# EAGLE design rs485Adaptor (EAGLE 8.5.1)
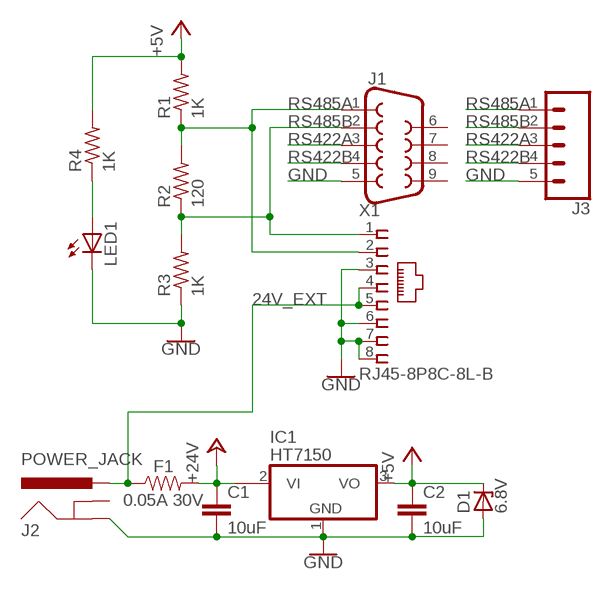
[diagram p0: schematic, sheet 1]

## Parts
C1  10uF  10UF-1206-6.3V-20%  [1206]
C2  10uF  C-EUC0805K  [C0805K]
D1  6.8V  ZENER-DIODESOD80C  [SOD80C]
F1  0.05A 30V  0.1OHM-1210-1/2W-1%  [1210]
IC1  HT7150  MCP170350MB  [SOT89]
J1  DB9FEMALE  [DB9]
J2  POWER_JACK  [POWER_JACK_PTH]
J3  CONN_05SCREW  [SCREWTERMINAL-3.5MM-5]
LED1  LEDCHIP-LED0805  [CHIP-LED0805]
R1  1K  R-US_R0805  [R0805]
R2  120  R-US_R0805  [R0805]
R3  1K  R-US_R0805  [R0805]
R4  1K  R-US_R0805  [R0805]
X1  RJ45-8P8C-8L-B  [RJ45-SHIELD-DS1128-S80BP]

## Nets
24V_EXT: F1.1 J2.PWR X1.4 X1.5
+5V: C2.1 D1.C IC1.3(VO) R1.2 R4.2
+24V: C1.1 F1.2 IC1.2@1(VI1)
GND: C1.2 C2.2 D1.A IC1.1(GND) J1.5 J2.GND J3.5 LED1.C R3.1 X1.3 X1.6 X1.7 X1.8
N$3: LED1.A R4.1
RS422A: J1.3 J3.3
RS422B: J1.4 J3.4
RS485A: J1.1 J3.1 R1.1 R2.2 X1.2
RS485B: J1.2 J3.2 R2.1 R3.2 X1.1
Unconnected: IC1.2(VI) J1.6 J1.7 J1.8 J1.9 J2.GNDBREAK

## Library data of the parts
C1 = SparkFun-Capacitors:10UF: 10.0µF ceramic capacitors A capacitor is a passive two-terminal electrical component used to store electrical energy temporarily in an electric field.; PROD_ID: CAP-10057
C2 = resistor:C-EU: CAPACITOR, European symbol
D1 = diode:ZENER-DIODE: Z-Diode
F1 = SparkFun-Resistors:0.1OHM: 0.1Ω resistor A resistor is a passive two-terminal electrical component that implements electrical resistance as a circuit element. Resistors act to reduce current flow, and, at the same time, act to lower voltage levels within circuits. - Wikipedia; PROD_ID: RES-12374; VALUE: 0.1
IC1 = linear:MCP1703*: 250 mA, 16V, Low Quiescent Current LDO Regulator Source: http://ww1.microchip.com/downloads/en/DeviceDoc/22049b.pdf
J1 = SparkFun-Connectors:DB9: DB9 Connector Standard DB9 (D-Sub 9) serial connector. Can be used for CAN bus as well as RS485 and RS232. Footprint production proven. Here is the female version connector we sell at SparkFun: 9 Pin Female Serial Connector - PCB Mount <https://www.sparkfun.com/products/429> (PRT-00429) This connector has been used on the following SparkFun products: SparkFun RS232 Shifter - SMD <https://www.sparkfun.com/products/449> (PRT-00449) SparkFun RS232 Shifter SMD (No DB9) <https://www.sparkfun.com/products/8780> (PRT-08780); PROD_ID: CONN-08194
J2 = SparkFun-Connectors:POWER_JACK: Power Jack Connector This is the standard 5.5mm barrel jack for power. The PTH is the most common, proven, reliable, footprint. The Slot footprint only works if the mill layer is transmitted to the PCB fab house so be warned. Here are the connectors we sell at SparkFun: DC Barrel Power Jack/Connector <https://www.sparkfun.com/products/119> (PRT-00119) DC Barrel Power Jack/Connector (SMD) <https://www.sparkfun.com/products/12748> (PRT-12748) DC Barrel Jack Adapter - Breadboard Compatible <https://www.sparkfun.com/products/10811> (PRT-10811) It is used on this SparkFun product (and many, many others): SparkFun RedBoard - Programmed with Arduino <https://www.sparkfun.com/products/12757> (DEV-12757) Also, if you need a mating power supply or connector, please check these out: Wall Adapter Power Supply - 9VDC 650mA <https://www.sparkfun.com/products/298> (TOL-00298) DC Barrel Jack Adapter - Male <https://www.sparkfun.com/products/10287> (PRT-10287); PROD_ID: CONN-08197
J3 = SparkFun-Connectors:CONN_05: Multi connection point. Often used as Generic Header-pin footprint for 0.1 inch spaced/style header connections On any of the 0.1 inch spaced packages, you can populate with these: Break Away Headers - Straight <https://www.sparkfun.com/products/116> (PRT-00116) Break Away Male Headers - Right Angle <https://www.sparkfun.com/products/553> (PRT-00553) Female Headers <https://www.sparkfun.com/products/115> (PRT-00115) Break Away Headers - Machine Pin <https://www.sparkfun.com/products/117> (PRT-00117) Break Away Female Headers - Swiss Machine Pin <https://www.sparkfun.com/products/743> (PRT-00743) For SCREWTERMINALS and SPRING TERMINALS visit here: Screw Terimnals on SparkFun.com <https://www.sparkfun.com/search/results?term=Screw+Terminals> (5mm/3.5mm/2.54mm spacing) This device is also useful as a general connection point to wire up your design to another part of your project. Our various solder wires solder well into these plated through hole pads. Hook-Up Wire - Assortment (Stranded, 22 AWG) <https://www.sparkfun.com/products/11375> (PRT-11375) Hook-Up Wire - Assortment (Solid Core, 22 AWG) <https://www.sparkfun.com/products/11367> (PRT-11367) View the entire wire category on our website here <https://www.sparkfun.com/categories/141> Special notes: Molex polarized connector foot print use with SKU : PRT-08231 with associated crimp pins and housings. 1MM SMD Version SKU: PRT-10208; PROD_ID: Combine 8288+8399
LED1 = led:LED: LED OSRAM: - CHIPLED LG R971, LG N971, LY N971, LG Q971, LY Q971, LO R971, LY R971 LH N974, LH R974 LS Q976, LO Q976, LY Q976 LO Q996 - Hyper CHIPLED LW Q18S LB Q993, LB Q99A, LB R99A - SideLED LS A670, LO A670, LY A670, LG A670, LP A670 LB A673, LV A673, LT A673, LW A673 LH A674 LY A675 LS A676, LA A676, LO A676, LY A676, LW A676 LS A679, LY A679, LG A679 - Hyper Micro SIDELED® LS Y876, LA Y876, LO Y876, LY Y876 LT Y87S - SmartLED LW L88C, LW L88S LB L89C, LB L89S, LG L890 LS L89K, LO L89K, LY L89K LS L896, LA L896, LO L896, LY L896 - TOPLED LS T670, LO T670, LY T670, LG T670, LP T670 LSG T670, LSP T670, LSY T670, LOP T670, LYG T670 LG T671, LOG T671, LSG T671 LB T673, LV T673, LT T673, LW T673 LH T674 LS T676, LA T676, LO T676, LY T676, LB T676, LH T676, LSB T676, LW T676 LB T67C, LV T67C, LT T67C, LS T67K, LO T67K, LY T67K, LW E67C LS E67B, LA E67B, LO E67B, LY E67B, LB E67C, LV E67C, LT E67C LW T67C LS T679, LY T679, LG T679 LS T770, LO T770, LY T770, LG T770, LP T770 LB T773, LV T773, LT T773, LW T773 LH T774 LS E675, LA E675, LY E675, LS T675 LS T776, LA T776, LO T776, LY T776, LB T776 LHGB T686 LT T68C, LB T68C - Hyper Mini TOPLED® LB M676 - Mini TOPLED Santana® LG M470 LS M47K, LO M47K, LY M47K Source: http://www.osram.convergy.de LUXEON: - LUMILED® LXK2-PW12-R00, LXK2-PW12-S00, LXK2-PW14-U00, LXK2-PW14-V00 LXK2-PM12-R00, LXK2-PM12-S00, LXK2-PM14-U00 LXK2-PE12-Q00, LXK2-PE12-R00, LXK2-PE12-S00, LXK2-PE14-T00, LXK2-PE14-U00 LXK2-PB12-K00, LXK2-PB12-L00, LXK2-PB12-M00, LXK2-PB14-N00, LXK2-PB14-P00, LXK2-PB14-Q00 LXK2-PR12-L00, LXK2-PR12-M00, LXK2-PR14-Q00, LXK2-PR14-R00 LXK2-PD12-Q00, LXK2-PD12-R00, LXK2-PD12-S00 LXK2-PH12-R00, LXK2-PH12-S00 LXK2-PL12-P00, LXK2-PL12-Q00, LXK2-PL12-R00 Source: www.luxeon.com KINGBRIGHT: KA-3528ASYC Source: www.kingbright.com
R1-R4 = resistor:R-US_: RESISTOR, American symbol
X1 = myownParts:RJ45-8P8C: CORCOM Modular RJ Jacks No Shield Source: www.tycoelectronics.com .. ENG_DS_1654001_1099_RJ_L_0507.pdf; MF: TYCO ELECTRONICS; MPN: RJ45-8L-B; OC_FARNELL: 1279843; OC_NEWARK: 52K4445

## Board
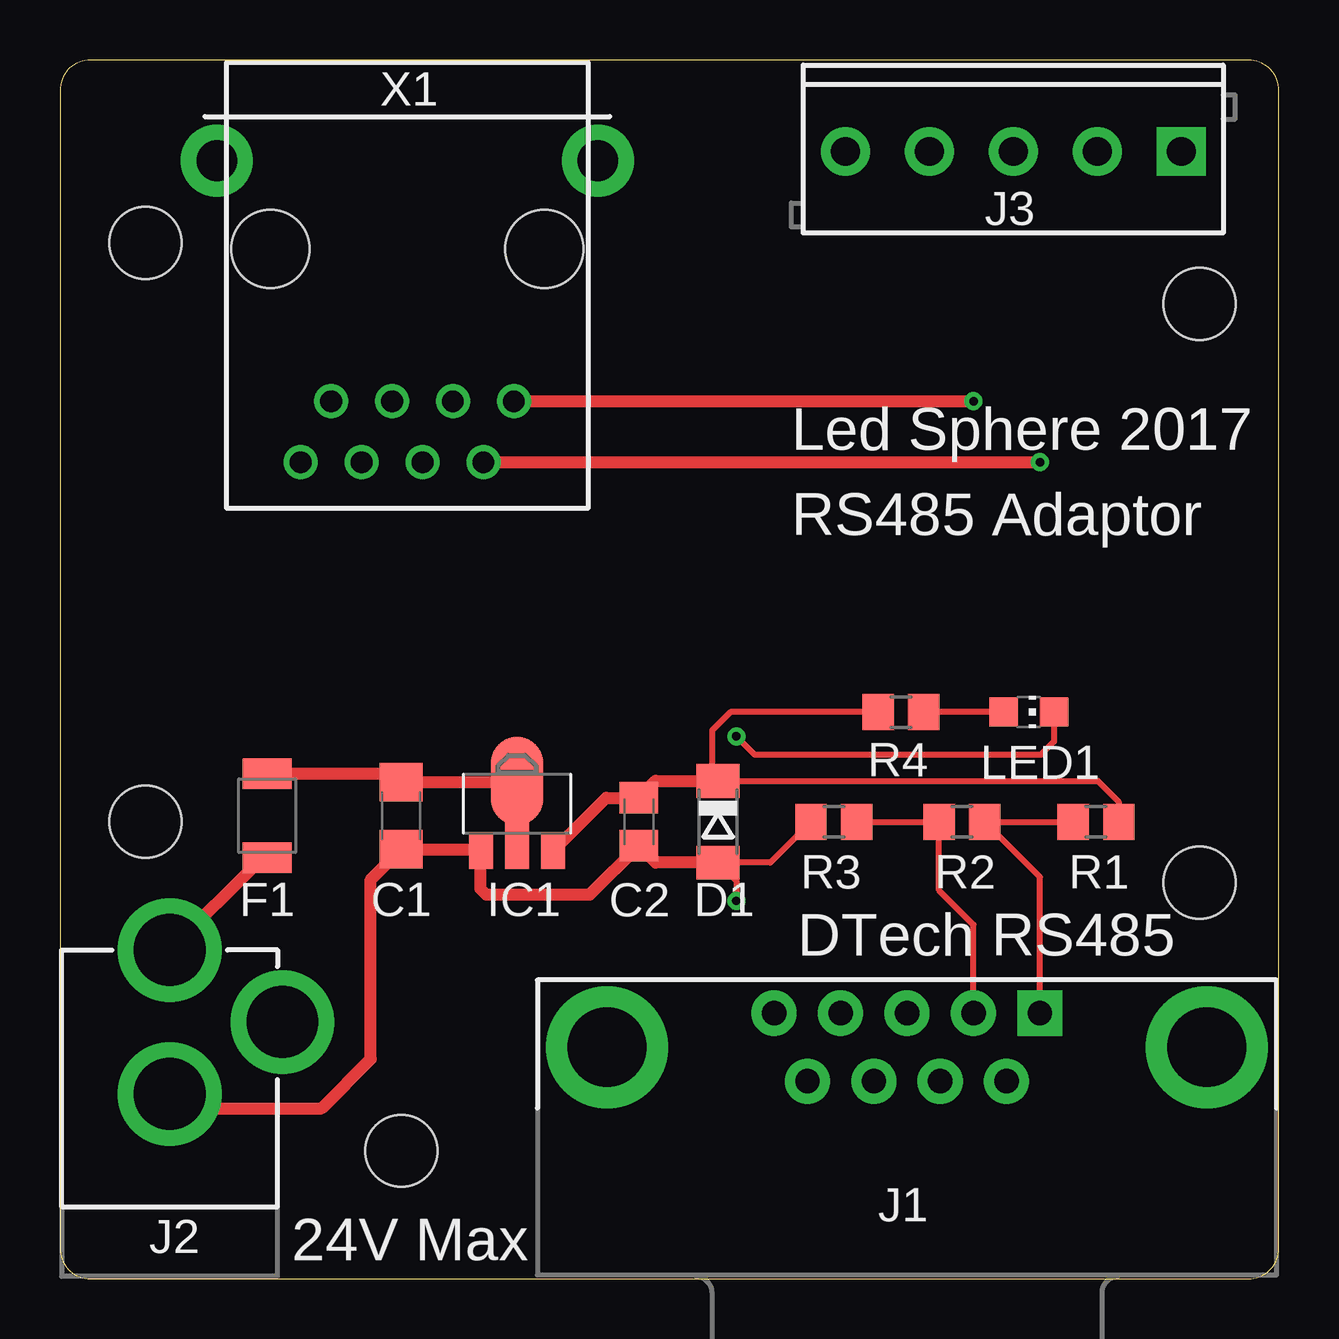
[diagram p1: board, top side]
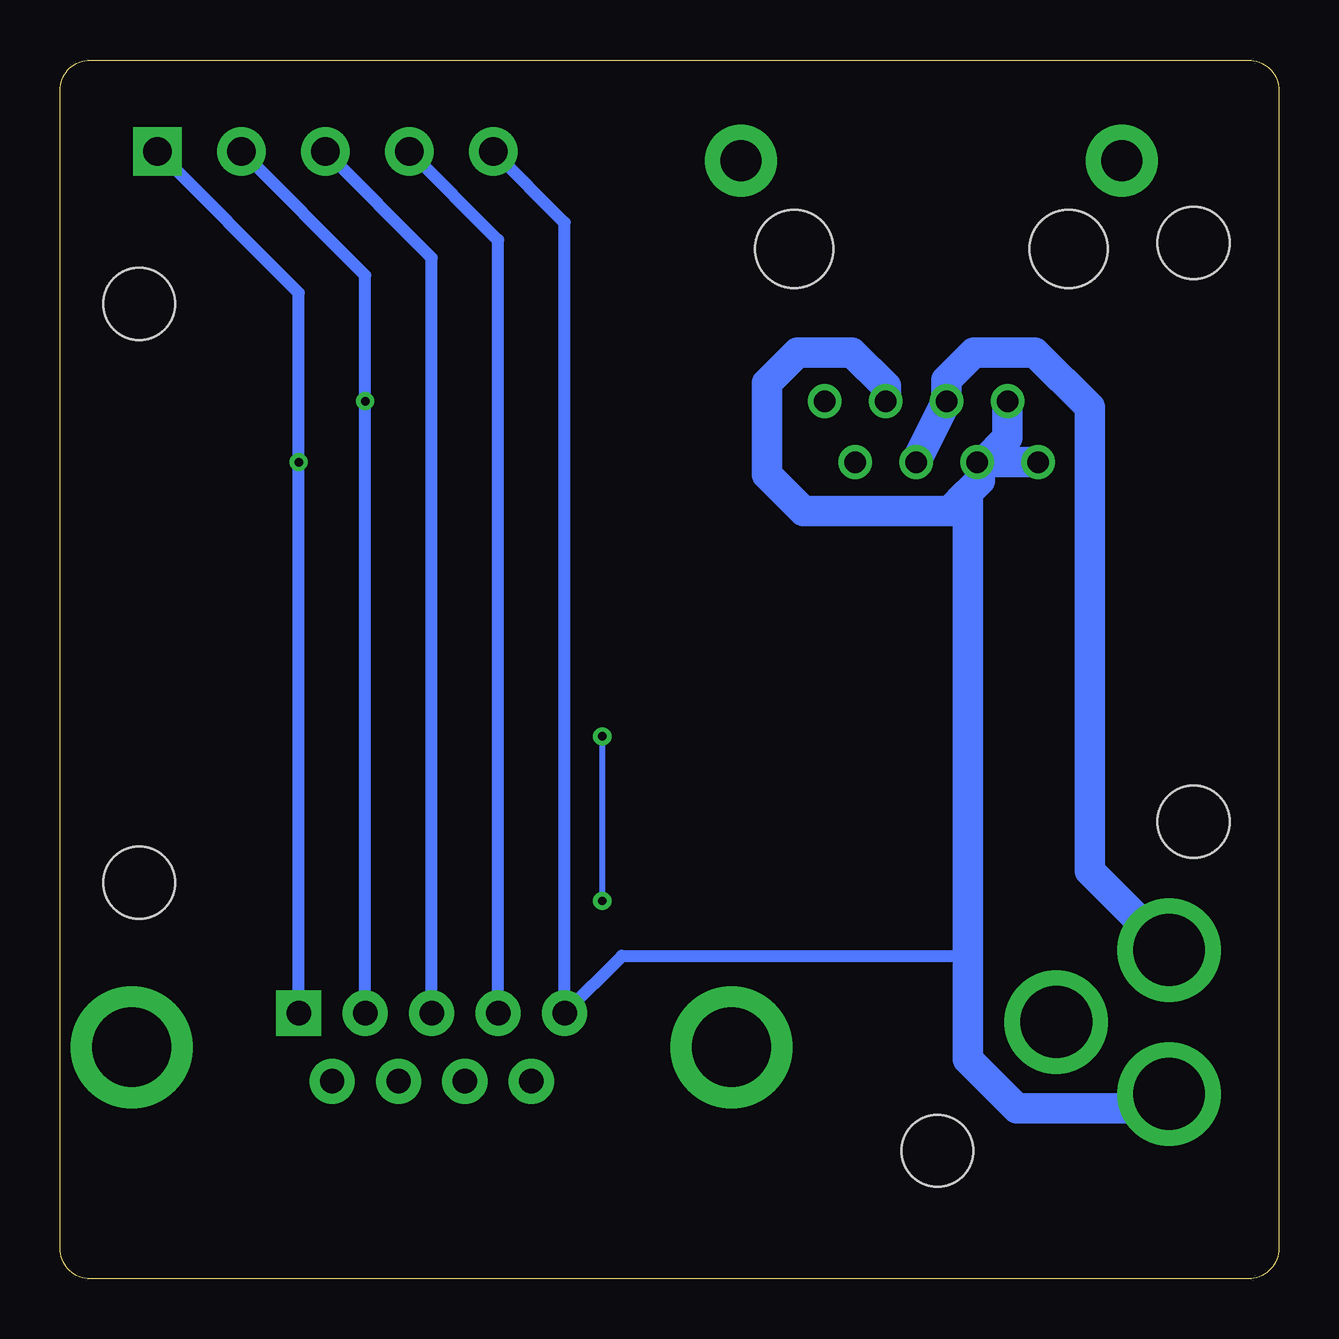
[diagram p2: board, bottom side, seen from below]

Size 50.8 x 50.8 mm. Coordinates in mm from the lower left corner, seen from the top.
Outline: 1.27,0 49.53,0 arc90 50.8,1.27 50.8,49.53 arc90 49.53,50.8 1.27,50.8 arc90 0,49.53 0,1.27 arc90 1.27,0
Copper layers (1*16): Top 0.035mm / dielectric 1.5mm / Bottom 0.035mm
Design rules "eagleRules": minimum track width 10mil, minimum drill 0.3mm, track to track 10mil, track to pad 10mil, pad to pad 10mil, via to via 10mil, smd to smd 10mil, copper to edge 20mil, drill to drill 20mil, minimum pad ring 10mil, minimum via ring 8mil, stop-mask expansion 4mil, vias tented up to drill 14mil, thermal gap 10mil
Holes 3 mm at 14.22,5.33 47.5,16.51 3.56,19.05 47.5,40.64 3.56,43.18

### Footprints (pad centres in the part's own frame; a part is rotated, then mirrored left to right if it is on the bottom)
1206 = smd 1.6 x 1.8: 1 -1.4,0; 2 1.4,0
C0805K = smd 1.3 x 1.6: 1 -1,0; 2 1,0
SOD80C = smd 1.4 x 1.8: A 1.7,0; C -1.7,0
1210 = smd 1.27 x 2.06: 1 -1.755,0; 2 1.755,0
SOT89 = smd 1 x 1.5: 1 -1.499,-1.981; 3 1.499,-1.981 | smd 1 x 2: 2 0,-1.727 | smd 2.2 x 3.7: 2@1 0,0.94
DB9 = drill 1.016 pad 1.88 square: 1 -5.54,-1.42 | drill 1.016 pad 1.88: 2 -2.77,-1.42; 3 0,-1.42; 4 2.77,-1.42; 5 5.54,-1.42; 6 -4.15,1.42; 7 -1.38,1.42; 8 1.38,1.42; 9 4.15,1.42 | drill 3.302 pad 5.08: G1 -12.5,0; G2 12.5,0
POWER_JACK_PTH = drill 2.997 pad 4.318: GND 0,7.7; GNDBREAK 4.7,10.7; PWR 0,13.7
SCREWTERMINAL-3.5MM-5 = drill 1.2 pad 2.032 square: 1 0,0 | drill 1.2 pad 2.032: 2 3.5,0; 3 7,0; 4 10.5,0; 5 14,0
CHIP-LED0805 = smd 1.2 x 1.2: A 0,-1.05; C 0,1.05
R0805 = smd 1.3 x 1.5: 1 -0.95,0; 2 0.95,0
RJ45-SHIELD-DS1128-S80BP = drill 0.9 pad 1.4: 1 -4.445,6.35; 2 -3.175,8.89; 3 -1.905,6.35; 4 -0.635,8.89; 5 0.635,6.35; 6 1.905,8.89; 7 3.175,6.35; 8 4.445,8.89 | drill 1.7 pad 3: SHIELD1 -7.94,-3.68; SHIELD2 7.94,-3.68 | hole 3.251: -5.715,0; 5.715,0

### Placement (x,y rotation side)
C1  14.22,19.3 270 top
C2  24.13,19.05 270 top
D1  27.43,19.05 270 top
F1  8.64,19.3 90 top
IC1  19.05,19.81 0 top
J1  35.31,9.65 180 top
J2  4.57,0 0 top
J3  46.74,46.99 180 top
LED1  40.39,23.62 270 top
R1  43.18,19.05 0 top
R2  37.59,19.05 0 top
R3  32.26,19.05 0 top
R4  35.05,23.62 180 top
X1  14.48,42.93 180 top

### Tracks (layer width: path | path; a pad name or v marks a point on that pad's centre or on a via)
24V_EXT
  Top 0.508: J2.PWR 8.42,17.55 F1.1
  Bottom 1.27: X1.4 X1.5 13.84,37.47 12.7,38.61 10.16,38.61 7.87,36.32 7.87,17 J2.PWR
+5V
  Top 0.254: D1.C 43.26,20.75 44.13,19.88 R1.2 | R4.2 27.94,23.62 27.18,22.86 27.18,21 26.92,20.75
  Top 0.508: IC1.3 22.77,20.05 C2.1 24.83,20.75 26.92,20.75 D1.C
+24V
  Top 0.508: F1.2 13.87,21.06 C1.1 19,20.7 IC1.2@1
GND  (via drill 0.35)
  Top 0.254: R3.1 29.61,17.35 D1.A 28.19,16.59 v28.19,15.75 | v28.19,22.61 28.96,21.84 40.89,21.84 41.44,22.39 LED1.C
  Top 0.508: J2.GND 5.16,7.11 10.92,7.11 12.95,9.14 12.95,16.63 C1.2 17.48,17.9 17.53,17.86 | 17.53,17.86 IC1.1 | 17.53,17.86 17.53,16.26 17.78,16 22.08,16 C2.2 24.83,17.35 D1.A
  Bottom 0.254: v28.19,15.75 v28.19,22.61
  Bottom 0.508: J3.5 29.77,44.02 J1.5 27.38,13.46 12.95,13.46
  Bottom 1.27: J2.GND 5.16,7.11 10.92,7.11 12.95,9.14 12.95,13.46 12.95,32.77 | 12.95,32.77 12.45,33.27 12.45,33.91 | 12.45,33.91 X1.6 | X1.7 11.3,35.05 12.32,34.04 | X1.8 12.32,34.04 | 12.32,34.04 12.45,33.91 | X1.3 16.38,37.21 17.78,38.61 20.07,38.61 21.34,37.34 21.34,33.53 19.81,32 13.72,32 12.95,32.77
N$3
  Top 0.254: LED1.A R4.1
RS422A
  Bottom 0.508: J1.3 35.31,42.56 J3.3
RS422B
  Bottom 0.508: J1.4 32.54,43.29 J3.4
RS485A  (via drill 0.35)
  Top 0.254: J1.1 40.85,16.75 R2.2 R1.1
  Top 0.508: X1.2 v40.85,34.04
  Bottom 0.508: J1.1 v40.85,34.04 40.85,41.1 J3.1
RS485B  (via drill 0.35)
  Top 0.254: J1.2 38.08,14.76 36.64,16.19 R2.1 R3.2
  Top 0.508: X1.1 v38.08,36.58
  Bottom 0.508: J1.2 v38.08,36.58 38.08,41.83 J3.2

### Text on the board
tNames: Led Sphere 2017 | RS485 Adaptor | DTech RS485 | 24V Max